# Altium schematic sheet Power.SchDoc: Power
size A4; CompanyName: TM; DrawnBy: Juan Tinazzo; DocumentNumber: 3; SheetNumber: 3; SheetTotal: 3; Number: DRV-PWR
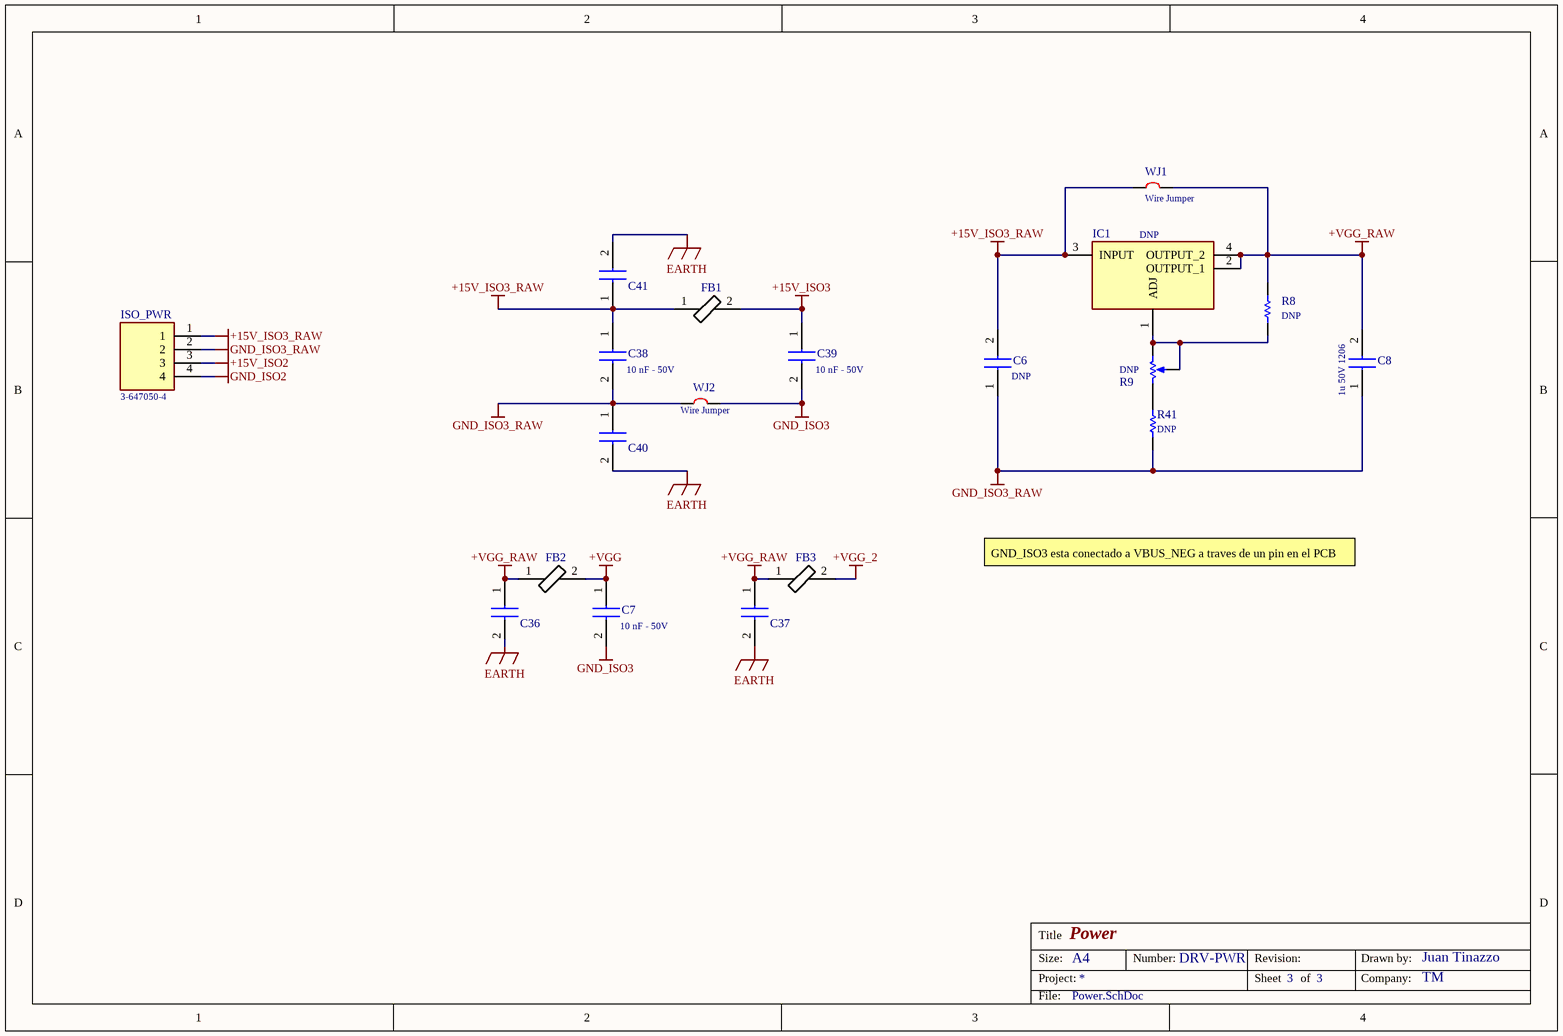
[diagram p0: Power.SchDoc]

## Parts
C6  DNP  [CAPC3216X180N]  (no BOM)
C7  value 10 nF - 50V  [CAPC1608X90N]  (hidden comment: CGA3E2X7R1H103K080AA)
C8  1u 50V 1206  [CAPC3216X180N]
C36  C1206C102KGRACAUTO  [C1206]  (value not drawn)
C37  C1206C102KGRACAUTO  [C1206]  (value not drawn)
C38  value 10 nF - 50V  [CAPC1608X90N]  (hidden comment: CGA3E2X7R1H103K080AA)
C39  value 10 nF - 50V  [CAPC1608X90N]  (hidden comment: CGA3E2X7R1H103K080AA)
C40  C1206C102KGRACAUTO  [C1206]  (value not drawn)
C41  C1206C102KGRACAUTO  [C1206]  (value not drawn)
FB1  78279220601  [BEADC2012X110N]  (value not drawn)
FB2  78279220601  [BEADC2012X110N]  (value not drawn)
FB3  78279220601  [BEADC2012X110N]  (value not drawn)
IC1  DNP  [SOT230P700X180-4N]  (no BOM)
ISO_PWR  3-647050-4  [SHDR4W66P0X254_1X4_1016X635X1079P]
R8  value DNP  [RESC1608X55N]  (hidden comment: CRCW0603220RFKEAC)  (no BOM)
R9  DNP  [3296W-1]  (no BOM)
R41  DNP  [RESC1608X55N]  (no BOM)
WJ1  Wire Jumper  (net tie, no BOM)
WJ2  Wire Jumper  (net tie, no BOM)

## Nets
+15V_ISO2: ISO_PWR.3
+15V_ISO3: C39.1 FB1.2
+15V_ISO3_RAW: C6.2 C38.1 C41.1 FB1.1 IC1.3(INPUT) ISO_PWR.1 WJ1.0
+VGG: C7.1 FB2.2
+VGG_2: FB3.2
+VGG_RAW: C8.2 C36.1 C37.1 FB2.1 FB3.1 IC1.2(OUTPUT_1) IC1.4(OUTPUT_2) R8.1 WJ1.1
EARTH: C36.2 C37.2 C40.2 C41.2
GND_ISO2: ISO_PWR.4
GND_ISO3: C7.2 C39.2 WJ2.1
GND_ISO3_RAW: C6.1 C8.1 C38.2 C40.1 ISO_PWR.2 R41.2 WJ2.0
NetIC1_1: IC1.1(ADJ) R8.2 R9.1(TOP) R9.2(BOT)
NetR9_3: R9.3(TAP) R41.1

## Notes on the sheet
- GND_ISO3 esta conectado a VBUS_NEG a traves de un pin en el PCB
- Title
- Size:
- Project:
- A4
- Number:
- Revision:
- Sheet
- of
- Drawn by:
- Company:
- File:

## Library data of the parts
C6 C8 = C3216X7R1H105K160AE: Capacitor; Manufacturer_Name: TDK; Value: 1 uF - 50V; Datasheet Link: https://product.tdk.com/info/en/catalog/datasheets/mlcc_commercial_midvoltage_en.pdf; Height: 1.8mm; Manufacturer_Part_Number: C3216X7R1H105K160AE; Mouser Part Number: 810-C3216X7R1H105KST; Mouser Price/Stock: https://www.mouser.co.uk/ProductDetail/TDK/C3216X7R1H105K160AE?qs=LcTL%2F5vFEzHWgMW0Em18fQ%3D%3D; Arrow Part Number: C3216X7R1H105K160AE; Arrow Price/Stock: https://www.arrow.com/en/products/c3216x7r1h105k160ae/tdk?region=nac
C7 C38 C39 = CGA3E2X7R1H103K080AA: Capacitor; Manufacturer_Name: TDK-Lambda; Datasheet Link: http://docs-europe.electrocomponents.com/webdocs/14e9/0900766b814e9125.pdf; Height: 0.9mm; Manufacturer_Part_Number: CGA3E2X7R1H103K080AA; Mouser Part Number: 810-CGA3E2X7R1H103K; Mouser Price/Stock: https://www.mouser.co.uk/ProductDetail/TDK/CGA3E2X7R1H103K080AA?qs=NRhsANhppD8MREuCb2mQKQ%3D%3D; Arrow Part Number: CGA3E2X7R1H103K080AA; Arrow Price/Stock: https://www.arrow.com/en/products/cga3e2x7r1h103k080aa/tdk?region=nac
C36 C37 C40 C41 = C1206C102KGRACAUTO: Capacitor; Manufacturer_Name: KEMET; Value: 1nF - 2000V; Datasheet Link: https://content.kemet.com/datasheets/KEM_C1076_X7R_HV_AUTO_SMD.pdf; Manufacturer_Part_Number: C1206C102KGRACAUTO; Mouser Part Number: 80-C1206C102KGRAUTO; Mouser Price/Stock: https://www.mouser.co.uk/ProductDetail/KEMET/C1206C102KGRACAUTO?qs=02kMkzikyGKenJNcwYLRQw%3D%3D; Arrow Part Number: C1206C102KGRACAUTO; Arrow Price/Stock: https://www.arrow.com/en/products/c1206c102kgracauto/kemet-corporation?region=nac
FB1-FB3 = 78279220601: Ferrite Bead; Manufacturer_Name: Wurth Elektronik; Value: Núcleos de ferrita WE-MPSA EMI 600Ohms 2.1A 80mOhms; Datasheet Link: https://www.mouser.de/datasheet/2/445/78279220601-2298574.pdf; Height: 1.1mm; Manufacturer_Part_Number: 78279220601; Mouser Part Number: 710-78279220601; Mouser Price/Stock: https://www.mouser.co.uk/ProductDetail/Wurth-Elektronik/78279220601?qs=iLbezkQI%252BsjgiK1FovJqGg%3D%3D
IC1 = NCP1117LPSTADT3G: Integrated Circuit; Manufacturer_Name: onsemi; Datasheet Link: http://www.onsemi.com/pub/Collateral/NCP1117LP-D.PDF; Height: 1.8mm; Manufacturer_Part_Number: NCP1117LPSTADT3G; Mouser Part Number: 863-NCP1117LPSTADT3G; Mouser Price/Stock: https://www.mouser.co.uk/ProductDetail/onsemi/NCP1117LPSTADT3G?qs=kbSN2QblFfLHsV%252B%252BQZ5KoA%3D%3D; Arrow Part Number: NCP1117LPSTADT3G; Arrow Price/Stock: https://www.arrow.com/en/products/ncp1117lpstadt3g/on-semiconductor?region=nac; Value: DNP
ISO_PWR = 3-647050-4: Connector; Manufacturer_Name: TE Connectivity; Value: Alojamientos de cables y cabecera HDR 02P VRT; Datasheet Link: https://www.te.com/commerce/DocumentDelivery/DDEController?Action=showdoc&DocId=Customer+Drawing%7F647050%7FU%7Fpdf%7FEnglish%7FENG_CD_647050_U.pdf%7F3-647050-4; Height: 10.79mm; Manufacturer_Part_Number: 3-647050-4; Mouser Part Number: 571-3-647050-4; Mouser Price/Stock: https://www.mouser.co.uk/ProductDetail/TE-Connectivity-AMP/3-647050-4?qs=W5ux9j661SoBsMK9vpa9%252BQ%3D%3D; Arrow Part Number: 3-647050-4; Arrow Price/Stock: https://www.arrow.com/en/products/3-647050-4/te-connectivity?region=nac; System: Connector
R8 = CRCW0603220RFKEAC: Resistor; Manufacturer_Name: Vishay; Datasheet Link: http://www.vishay.com/docs/28773/crcwce3.pdf; Height: 0.55mm; Manufacturer_Part_Number: CRCW0603220RFKEAC; Mouser Part Number: 71-CRCW0603220RFKEAC; Mouser Price/Stock: https://www.mouser.co.uk/ProductDetail/Vishay-Dale/CRCW0603220RFKEAC?qs=E3Y5ESvWgWOUrnKUP8Zt%2Fg%3D%3D; Arrow Part Number: CRCW0603220RFKEAC; Arrow Price/Stock: https://www.arrow.com/en/products/crcw0603220rfkeac/vishay?region=nac
R9 = 3296W-1-502LF: Resistor; Manufacturer_Name: Bourns; Value: 5k - DNP; Datasheet Link: https://componentsearchengine.com/Datasheets/2/3296W-1-502LF.pdf; Manufacturer_Part_Number: 3296W-1-502LF; Mouser Part Number: 652-3296W-1-502LF; Mouser Price/Stock: https://www.mouser.co.uk/ProductDetail/Bourns/3296W-1-502LF?qs=zl1BDXJPZVrTnesl5BcuCQ%3D%3D; Arrow Part Number: 3296W-1-502LF; Arrow Price/Stock: https://www.arrow.com/en/products/3296w-1-502lf/bourns?region=europe
R41 = ERJ-3EKF6800V: Resistor; Manufacturer_Name: Panasonic; Value: 680 Ohm - 1/10 W; Datasheet Link: http://industrial.panasonic.com/cdbs/www-data/pdf/RDA0000/AOA0000C86.pdf; Height: 0.55mm; Manufacturer_Part_Number: ERJ-3EKF6800V; Mouser Part Number: 667-ERJ-3EKF6800V; Mouser Price/Stock: https://www.mouser.co.uk/ProductDetail/Panasonic/ERJ-3EKF6800V?qs=iBwFsHVUAOdujdiQBDzX2w%3D%3D; Arrow Part Number: ERJ-3EKF6800V; Arrow Price/Stock: https://www.arrow.com/en/products/erj-3ekf6800v/panasonic
WJ1 WJ2 = Wire Jumper: Manufacturer_Part_Number: Wire; Value: Jumper